# EasyEDA schematic SCH_Roboliga_2026_Futbol_2026-04-12.json
TITLE: Placa Base Robot Soccer 2026; REV: 1.0; Date: 2026-04-01; Sheet: 1/1; Drawn By: enzzo195; Company: IITA Salta
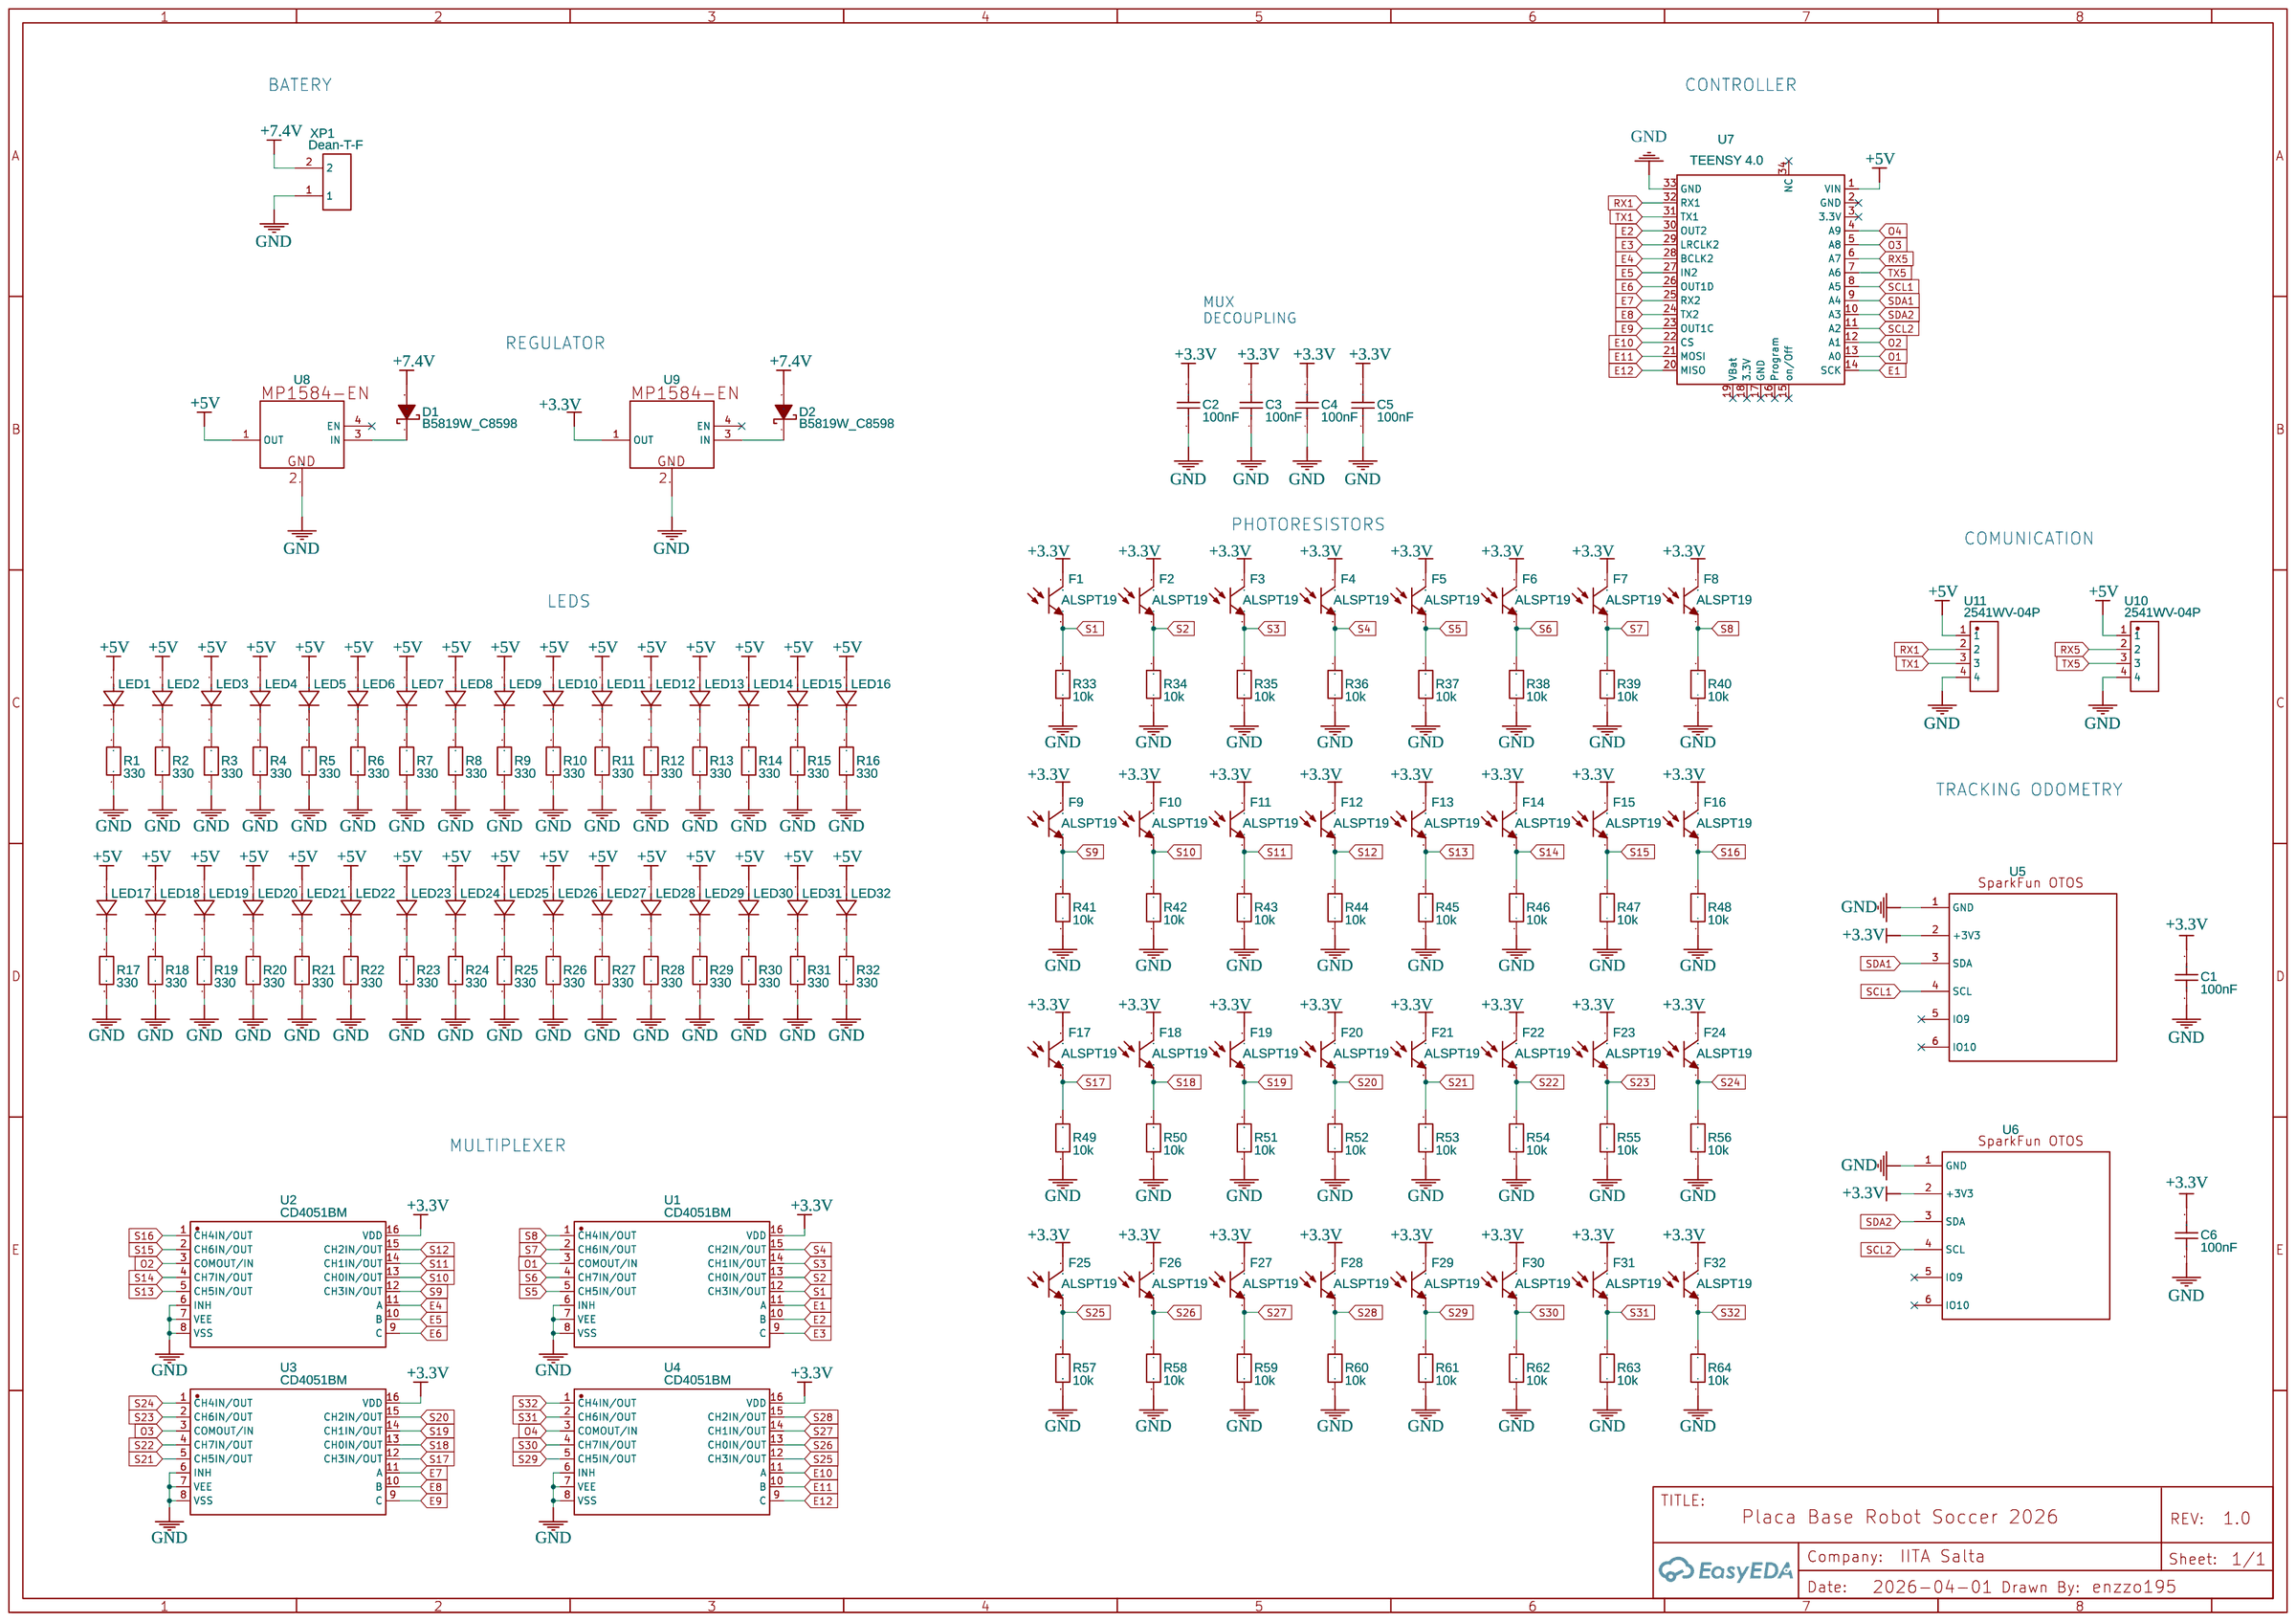
[diagram p0: schematic sheet]

## Parts
C1  100nF  [C0603]
C2  100nF  [C0603]
C3  100nF  [C0603]
C4  100nF  [C0603]
C5  100nF  [C0603]
C6  100nF  [C0603]
D1  B5819W_C8598  [SOD-123_L2.7-W1.6-LS3.7-RD-1]
D2  B5819W_C8598  [SOD-123_L2.7-W1.6-LS3.7-RD-1]
F1  ALSPT19  [SENSORS-SMD_ALS-PT19]
F2  ALSPT19  [SENSORS-SMD_ALS-PT19]
F3  ALSPT19  [SENSORS-SMD_ALS-PT19]
F4  ALSPT19  [SENSORS-SMD_ALS-PT19]
F5  ALSPT19  [SENSORS-SMD_ALS-PT19]
F6  ALSPT19  [SENSORS-SMD_ALS-PT19]
F7  ALSPT19  [SENSORS-SMD_ALS-PT19]
F8  ALSPT19  [SENSORS-SMD_ALS-PT19]
F9  ALSPT19  [SENSORS-SMD_ALS-PT19]
F10  ALSPT19  [SENSORS-SMD_ALS-PT19]
F11  ALSPT19  [SENSORS-SMD_ALS-PT19]
F12  ALSPT19  [SENSORS-SMD_ALS-PT19]
F13  ALSPT19  [SENSORS-SMD_ALS-PT19]
F14  ALSPT19  [SENSORS-SMD_ALS-PT19]
F15  ALSPT19  [SENSORS-SMD_ALS-PT19]
F16  ALSPT19  [SENSORS-SMD_ALS-PT19]
F17  ALSPT19  [SENSORS-SMD_ALS-PT19]
F18  ALSPT19  [SENSORS-SMD_ALS-PT19]
F19  ALSPT19  [SENSORS-SMD_ALS-PT19]
F20  ALSPT19  [SENSORS-SMD_ALS-PT19]
F21  ALSPT19  [SENSORS-SMD_ALS-PT19]
F22  ALSPT19  [SENSORS-SMD_ALS-PT19]
F23  ALSPT19  [SENSORS-SMD_ALS-PT19]
F24  ALSPT19  [SENSORS-SMD_ALS-PT19]
F25  ALSPT19  [SENSORS-SMD_ALS-PT19]
F26  ALSPT19  [SENSORS-SMD_ALS-PT19]
F27  ALSPT19  [SENSORS-SMD_ALS-PT19]
F28  ALSPT19  [SENSORS-SMD_ALS-PT19]
F29  ALSPT19  [SENSORS-SMD_ALS-PT19]
F30  ALSPT19  [SENSORS-SMD_ALS-PT19]
F31  ALSPT19  [SENSORS-SMD_ALS-PT19]
F32  ALSPT19  [SENSORS-SMD_ALS-PT19]
LED1  LED402O  [LED-SMD_YLED0402O]
LED2  LED402O  [LED-SMD_YLED0402O]
LED3  LED402O  [LED-SMD_YLED0402O]
LED4  LED402O  [LED-SMD_YLED0402O]
LED5  LED402O  [LED-SMD_YLED0402O]
LED6  LED402O  [LED-SMD_YLED0402O]
LED7  LED402O  [LED-SMD_YLED0402O]
LED8  LED402O  [LED-SMD_YLED0402O]
LED9  LED402O  [LED-SMD_YLED0402O]
LED10  LED402O  [LED-SMD_YLED0402O]
LED11  LED402O  [LED-SMD_YLED0402O]
LED12  LED402O  [LED-SMD_YLED0402O]
LED13  LED402O  [LED-SMD_YLED0402O]
LED14  LED402O  [LED-SMD_YLED0402O]
LED15  LED402O  [LED-SMD_YLED0402O]
LED16  LED402O  [LED-SMD_YLED0402O]
LED17  LED402O  [LED-SMD_YLED0402O]
LED18  LED402O  [LED-SMD_YLED0402O]
LED19  LED402O  [LED-SMD_YLED0402O]
LED20  LED402O  [LED-SMD_YLED0402O]
LED21  LED402O  [LED-SMD_YLED0402O]
LED22  LED402O  [LED-SMD_YLED0402O]
LED23  LED402O  [LED-SMD_YLED0402O]
LED24  LED402O  [LED-SMD_YLED0402O]
LED25  LED402O  [LED-SMD_YLED0402O]
LED26  LED402O  [LED-SMD_YLED0402O]
LED27  LED402O  [LED-SMD_YLED0402O]
LED28  LED402O  [LED-SMD_YLED0402O]
LED29  LED402O  [LED-SMD_YLED0402O]
LED30  LED402O  [LED-SMD_YLED0402O]
LED31  LED402O  [LED-SMD_YLED0402O]
LED32  LED402O  [LED-SMD_YLED0402O]
R1  330  [R0603]
R2  330  [R0603]
R3  330  [R0603]
R4  330  [R0603]
R5  330  [R0603]
R6  330  [R0603]
R7  330  [R0603]
R8  330  [R0603]
R9  330  [R0603]
R10  330  [R0603]
R11  330  [R0603]
R12  330  [R0603]
R13  330  [R0603]
R14  330  [R0603]
R15  330  [R0603]
R16  330  [R0603]
R17  330  [R0603]
R18  330  [R0603]
R19  330  [R0603]
R20  330  [R0603]
R21  330  [R0603]
R22  330  [R0603]
R23  330  [R0603]
R24  330  [R0603]
R25  330  [R0603]
R26  330  [R0603]
R27  330  [R0603]
R28  330  [R0603]
R29  330  [R0603]
R30  330  [R0603]
R31  330  [R0603]
R32  330  [R0603]
R33  10k  [R0603]
R34  10k  [R0603]
R35  10k  [R0603]
R36  10k  [R0603]
R37  10k  [R0603]
R38  10k  [R0603]
R39  10k  [R0603]
R40  10k  [R0603]
R41  10k  [R0603]
R42  10k  [R0603]
R43  10k  [R0603]
R44  10k  [R0603]
R45  10k  [R0603]
R46  10k  [R0603]
R47  10k  [R0603]
R48  10k  [R0603]
R49  10k  [R0603]
R50  10k  [R0603]
R51  10k  [R0603]
R52  10k  [R0603]
R53  10k  [R0603]
R54  10k  [R0603]
R55  10k  [R0603]
R56  10k  [R0603]
R57  10k  [R0603]
R58  10k  [R0603]
R59  10k  [R0603]
R60  10k  [R0603]
R61  10k  [R0603]
R62  10k  [R0603]
R63  10k  [R0603]
R64  10k  [R0603]
U1  CD4051BM  [SOIC-16_L9.9-W3.9-P1.27-LS6.0-BL]
U2  CD4051BM  [SOIC-16_L9.9-W3.9-P1.27-LS6.0-BL]
U3  CD4051BM  [SOIC-16_L9.9-W3.9-P1.27-LS6.0-BL]
U4  CD4051BM  [SOIC-16_L9.9-W3.9-P1.27-LS6.0-BL]
U5  SparkFun OTOS  [SPARFUN OTOS HEADER]
U6  SparkFun OTOS  [SPARFUN OTOS HEADER]
U7  TEENSY 4.0  [COMM-TH_34P-L35.6-W17.8-P2.54_C9900133251]
U8  MP1584EN 4-Pin SIP Module  [MP1584EN-MINI-4-PIN]
U9  MP1584EN 4-Pin SIP Module  [MP1584EN-MINI-4-PIN]
U10  2541WV-04P  [HDR-TH_4P-P2.54-V-M-1]
U11  2541WV-04P  [HDR-TH_4P-P2.54-V-M-1]
XP1  Dean-T-F  [DEAN-T-F]

## Library data of the parts
C1-C6 = C_0603_US: Contributor: LCEDA_Lib
D1 D2 = B5819W_C8598: Supplier: LCSC; Manufacturer: CJ(江苏长电/长晶); Manufacturer Part: B5819W SL; Supplier Part: C8598; JLCPCB Part Class: Basic Part
F1-F32 = ALS-PT19-315C/L177/TR8: Contributor: LCSC; Supplier: LCSC; Manufacturer: EVERLIGHT(亿光); Supplier Part: C146233; JLCPCB Part Class: Extended Part
LED1-LED32 = YLED0402O: Supplier: LCSC; Supplier Part: C28310436; Manufacturer: YONGYUTAI(永裕泰); JLCPCB Part Class: Extended Part; Contributor: lcsc
R1-R64 = R_0603_EU: Contributor: LCEDA_Lib
U1-U4 = CD4051BM: Supplier: LCSC; Supplier Part: C353976; Manufacturer: TI(德州仪器); Contributor: lcsc; JLCPCB Part Class: Extended Part
U5 U6 = SparkFun OTOS: Manufacturer: Sparkfun; Contributor: nathandu7100
U7 = TEENSY 4.0: Supplier: LCSC; Supplier Part: C9900133251; Manufacturer: null; Manufacturer Part: Teensy 4.0; JLCPCB Part Class: Extended Part; Contributor: lcsc
U8 U9 = MP1584EN 4-Pin SIP Module: Contributor: obadiah.grotts
U10 U11 = 2541WV-04P: Contributor: lcsc; Supplier: LCSC; Supplier Part: C5383113; Manufacturer: HanElectricity(瀚源); JLCPCB Part Class: Extended Part
XP1 = Dean-T-F: Contributor: irina.grishkovets22101999

## Nets
+3.3V: C1.2 C2.2 C3.2 C4.2 C5.2 C6.2 F1.1(C) F2.1(C) F3.1(C) F4.1(C) F5.1(C) F6.1(C) F7.1(C) F8.1(C) F9.1(C) F10.1(C) F11.1(C) F12.1(C) F13.1(C) F14.1(C) F15.1(C) F16.1(C) F17.1(C) F18.1(C) F19.1(C) F20.1(C) F21.1(C) F22.1(C) F23.1(C) F24.1(C) F25.1(C) F26.1(C) F27.1(C) F28.1(C) F29.1(C) F30.1(C) F31.1(C) F32.1(C) U1.16(VDD) U2.16(VDD) U3.16(VDD) U4.16(VDD) U5.2(+3V3) U6.2(+3V3) U9.1(OUT)
+5V: LED1.1(A) LED2.1(A) LED3.1(A) LED4.1(A) LED5.1(A) LED6.1(A) LED7.1(A) LED8.1(A) LED9.1(A) LED10.1(A) LED11.1(A) LED12.1(A) LED13.1(A) LED14.1(A) LED15.1(A) LED16.1(A) LED17.1(A) LED18.1(A) LED19.1(A) LED20.1(A) LED21.1(A) LED22.1(A) LED23.1(A) LED24.1(A) LED25.1(A) LED26.1(A) LED27.1(A) LED28.1(A) LED29.1(A) LED30.1(A) LED31.1(A) LED32.1(A) U7.1(VIN) U8.1(OUT) U10.1 U11.1
+7.4V: D1.2(+) D2.2(+) XP1.2
GND: C1.1 C2.1 C3.1 C4.1 C5.1 C6.1 R1.1 R2.1 R3.1 R4.1 R5.1 R6.1 R7.1 R8.1 R9.1 R10.1 R11.1 R12.1 R13.1 R14.1 R15.1 R16.1 R17.1 R18.1 R19.1 R20.1 R21.1 R22.1 R23.1 R24.1 R25.1 R26.1 R27.1 R28.1 R29.1 R30.1 R31.1 R32.1 R33.1 R34.1 R35.1 R36.1 R37.1 R38.1 R39.1 R40.1 R41.1 R42.1 R43.1 R44.1 R45.1 R46.1 R47.1 R48.1 R49.1 R50.1 R51.1 R52.1 R53.1 R54.1 R55.1 R56.1 R57.1 R58.1 R59.1 R60.1 R61.1 R62.1 R63.1 R64.1 U1.6(INH) U1.7(VEE) U1.8(VSS) U2.6(INH) U2.7(VEE) U2.8(VSS) U3.6(INH) U3.7(VEE) U3.8(VSS) U4.6(INH) U4.7(VEE) U4.8(VSS) U5.1(GND) U6.1(GND) U7.33(GND) U8.2(GND) U9.2(GND) U10.4 U11.4 XP1.1
E1: U1.11(A) U7.14(SCK)
E2: U1.10(B) U7.30(OUT2)
E3: U1.9(C) U7.29(LRCLK2)
E4: U2.11(A) U7.28(BCLK2)
E5: U2.10(B) U7.27(IN2)
E6: U2.9(C) U7.26(OUT1D)
E7: U3.11(A) U7.25(RX2)
E8: U3.10(B) U7.24(TX2)
E9: U3.9(C) U7.23(OUT1C)
E10: U4.11(A) U7.22(CS)
E11: U4.10(B) U7.21(MOSI)
E12: U4.9(C) U7.20(MISO)
O1: U1.3(COMOUT/IN) U7.13(A0)
O2: U2.3(COMOUT/IN) U7.12(A1)
O3: U3.3(COMOUT/IN) U7.5(A8)
O4: U4.3(COMOUT/IN) U7.4(A9)
RX1: U7.32(RX1) U11.2
RX5: U7.6(A7) U10.2
S1: F1.2(E) R33.2 U1.12(CH3IN/OUT)
S2: F2.2(E) R34.2 U1.13(CH0IN/OUT)
S3: F3.2(E) R35.2 U1.14(CH1IN/OUT)
S4: F4.2(E) R36.2 U1.15(CH2IN/OUT)
S5: F5.2(E) R37.2 U1.5(CH5IN/OUT)
S6: F6.2(E) R38.2 U1.4(CH7IN/OUT)
S7: F7.2(E) R39.2 U1.2(CH6IN/OUT)
S8: F8.2(E) R40.2 U1.1(CH4IN/OUT)
S9: F9.2(E) R41.2 U2.12(CH3IN/OUT)
S10: F10.2(E) R42.2 U2.13(CH0IN/OUT)
S11: F11.2(E) R43.2 U2.14(CH1IN/OUT)
S12: F12.2(E) R44.2 U2.15(CH2IN/OUT)
S13: F13.2(E) R45.2 U2.5(CH5IN/OUT)
S14: F14.2(E) R46.2 U2.4(CH7IN/OUT)
S15: F15.2(E) R47.2 U2.2(CH6IN/OUT)
S16: F16.2(E) R48.2 U2.1(CH4IN/OUT)
S17: F17.2(E) R49.2 U3.12(CH3IN/OUT)
S18: F18.2(E) R50.2 U3.13(CH0IN/OUT)
S19: F19.2(E) R51.2 U3.14(CH1IN/OUT)
S20: F20.2(E) R52.2 U3.15(CH2IN/OUT)
S21: F21.2(E) R53.2 U3.5(CH5IN/OUT)
S22: F22.2(E) R54.2 U3.4(CH7IN/OUT)
S23: F23.2(E) R55.2 U3.2(CH6IN/OUT)
S24: F24.2(E) R56.2 U3.1(CH4IN/OUT)
S25: F25.2(E) R57.2 U4.12(CH3IN/OUT)
S26: F26.2(E) R58.2 U4.13(CH0IN/OUT)
S27: F27.2(E) R59.2 U4.14(CH1IN/OUT)
S28: F28.2(E) R60.2 U4.15(CH2IN/OUT)
S29: F29.2(E) R61.2 U4.5(CH5IN/OUT)
S30: F30.2(E) R62.2 U4.4(CH7IN/OUT)
S31: F31.2(E) R63.2 U4.2(CH6IN/OUT)
S32: F32.2(E) R64.2 U4.1(CH4IN/OUT)
SCL1: U5.4(SCL) U7.8(A5)
SCL2: U6.4(SCL) U7.11(A2)
SDA1: U5.3(SDA) U7.9(A4)
SDA2: U6.3(SDA) U7.10(A3)
TX1: U7.31(TX1) U11.3
TX5: U7.7(A6) U10.3
Net-(D1-1): D1.1(-) U8.3(IN)
Net-(D2-1): D2.1(-) U9.3(IN)
Net-(LED1-2): LED1.2(C) R1.2
Net-(LED2-2): LED2.2(C) R2.2
Net-(LED3-2): LED3.2(C) R3.2
Net-(LED4-2): LED4.2(C) R4.2
Net-(LED5-2): LED5.2(C) R5.2
Net-(LED6-2): LED6.2(C) R6.2
Net-(LED7-2): LED7.2(C) R7.2
Net-(LED8-2): LED8.2(C) R8.2
Net-(LED9-2): LED9.2(C) R9.2
Net-(LED10-2): LED10.2(C) R10.2
Net-(LED11-2): LED11.2(C) R11.2
Net-(LED12-2): LED12.2(C) R12.2
Net-(LED13-2): LED13.2(C) R13.2
Net-(LED14-2): LED14.2(C) R14.2
Net-(LED15-2): LED15.2(C) R15.2
Net-(LED16-2): LED16.2(C) R16.2
Net-(LED17-2): LED17.2(C) R17.2
Net-(LED18-2): LED18.2(C) R18.2
Net-(LED19-2): LED19.2(C) R19.2
Net-(LED20-2): LED20.2(C) R20.2
Net-(LED21-2): LED21.2(C) R21.2
Net-(LED22-2): LED22.2(C) R22.2
Net-(LED23-2): LED23.2(C) R23.2
Net-(LED24-2): LED24.2(C) R24.2
Net-(LED25-2): LED25.2(C) R25.2
Net-(LED26-2): LED26.2(C) R26.2
Net-(LED27-2): LED27.2(C) R27.2
Net-(LED28-2): LED28.2(C) R28.2
Net-(LED29-2): LED29.2(C) R29.2
Net-(LED30-2): LED30.2(C) R30.2
Net-(LED31-2): LED31.2(C) R31.2
Net-(LED32-2): LED32.2(C) R32.2

Not connected (* = marked no-connect by the designer): U5 5(IO9)* 6(IO10)*; U6 5(IO9)* 6(IO10)*; U7 2(GND)* 3(3.3V)* 15(on/Off)* 16(Program)* 17(GND)* 18(3.3V)* 19(VBat)* 34(NC)*; U8 4(EN)*; U9 4(EN)*

## Notes on the sheet
- BATERY
- CONTROLLER
- MUX
  DECOUPLING
- REGULATOR
- PHOTORESISTORS
- COMUNICATION
- LEDS
- TRACKING ODOMETRY
- MULTIPLEXER
